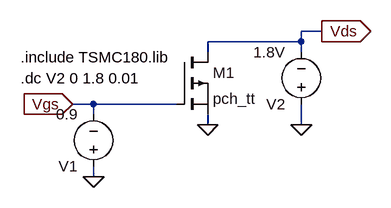
[diagram p0: schematic Prob_4c2.asc]
Prob_4c2.asc, the LTspice schematic file:
Version 4
SHEET 1 880 680
WIRE 0 144 -32 144
WIRE -32 160 -32 144
WIRE -32 160 -176 160
WIRE -176 176 -176 160
WIRE -32 176 -32 160
WIRE -352 256 -384 256
WIRE -224 256 -352 256
WIRE -352 272 -352 256
WIRE -176 288 -176 272
WIRE -32 288 -32 256
WIRE -352 368 -352 352
FLAG -352 368 0
FLAG -176 288 0
FLAG -32 288 0
FLAG -384 256 Vgs
IOPIN -384 256 In
FLAG 0 144 Vds
IOPIN 0 144 Out
SYMBOL voltage -352 368 R180
WINDOW 123 0 0 Left 0
WINDOW 39 0 0 Left 0
SYMATTR InstName V1
SYMATTR Value 0.9
SYMBOL voltage -32 272 R180
WINDOW 123 0 0 Left 0
WINDOW 39 0 0 Left 0
SYMATTR InstName V2
SYMATTR Value 1.8V
SYMBOL pmos -224 176 R0
SYMATTR InstName M1
SYMATTR Value pch_tt
TEXT -464 184 Left 2 !.include TSMC180.lib
TEXT -464 216 Left 2 !.dc V2 0 1.8 0.01

The netlist it stands for:
* Prob_4c2.asc
V1 0 Vgs 0.9
V2 0 Vds 1.8V
M1 Vds Vgs 0 0 pch_tt
.model NMOS NMOS
.model PMOS PMOS
.lib standard.mos
.include TSMC180.lib
.dc V2 0 1.8 0.01
.backanno
.end